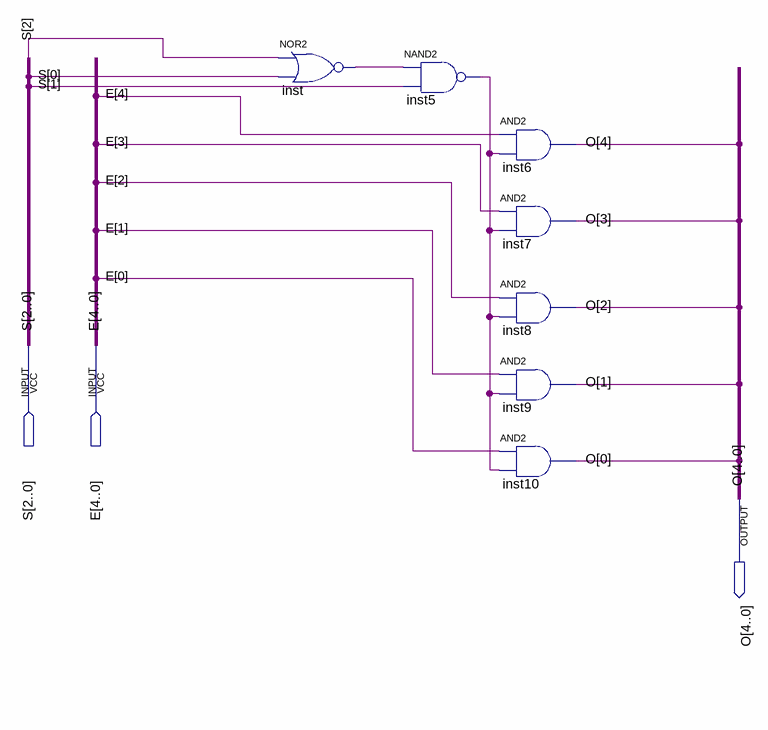
[diagram p0: schematic sheet]
// Quartus schematic SelectorToBComplement.bdf as structural Verilog: 7 symbols, 3 pins
module SelectorToBComplement (
  input  [2:0] S,
  input  [4:0] E,
  output [4:0] O
);

  wire inst5_out, inst_out;

  nor inst (inst_out, S[2], S[0]);
  nand inst5 (inst5_out, inst_out, S[1]);
  and inst6 (O[4], E[4], inst5_out);
  and inst7 (O[3], E[3], inst5_out);
  and inst8 (O[2], E[2], inst5_out);
  and inst9 (O[1], E[1], inst5_out);
  and inst10 (O[0], E[0], inst5_out);
endmodule
